# Altium project 50ohm-diff_converter.PrjPcb (part 3 of 3)
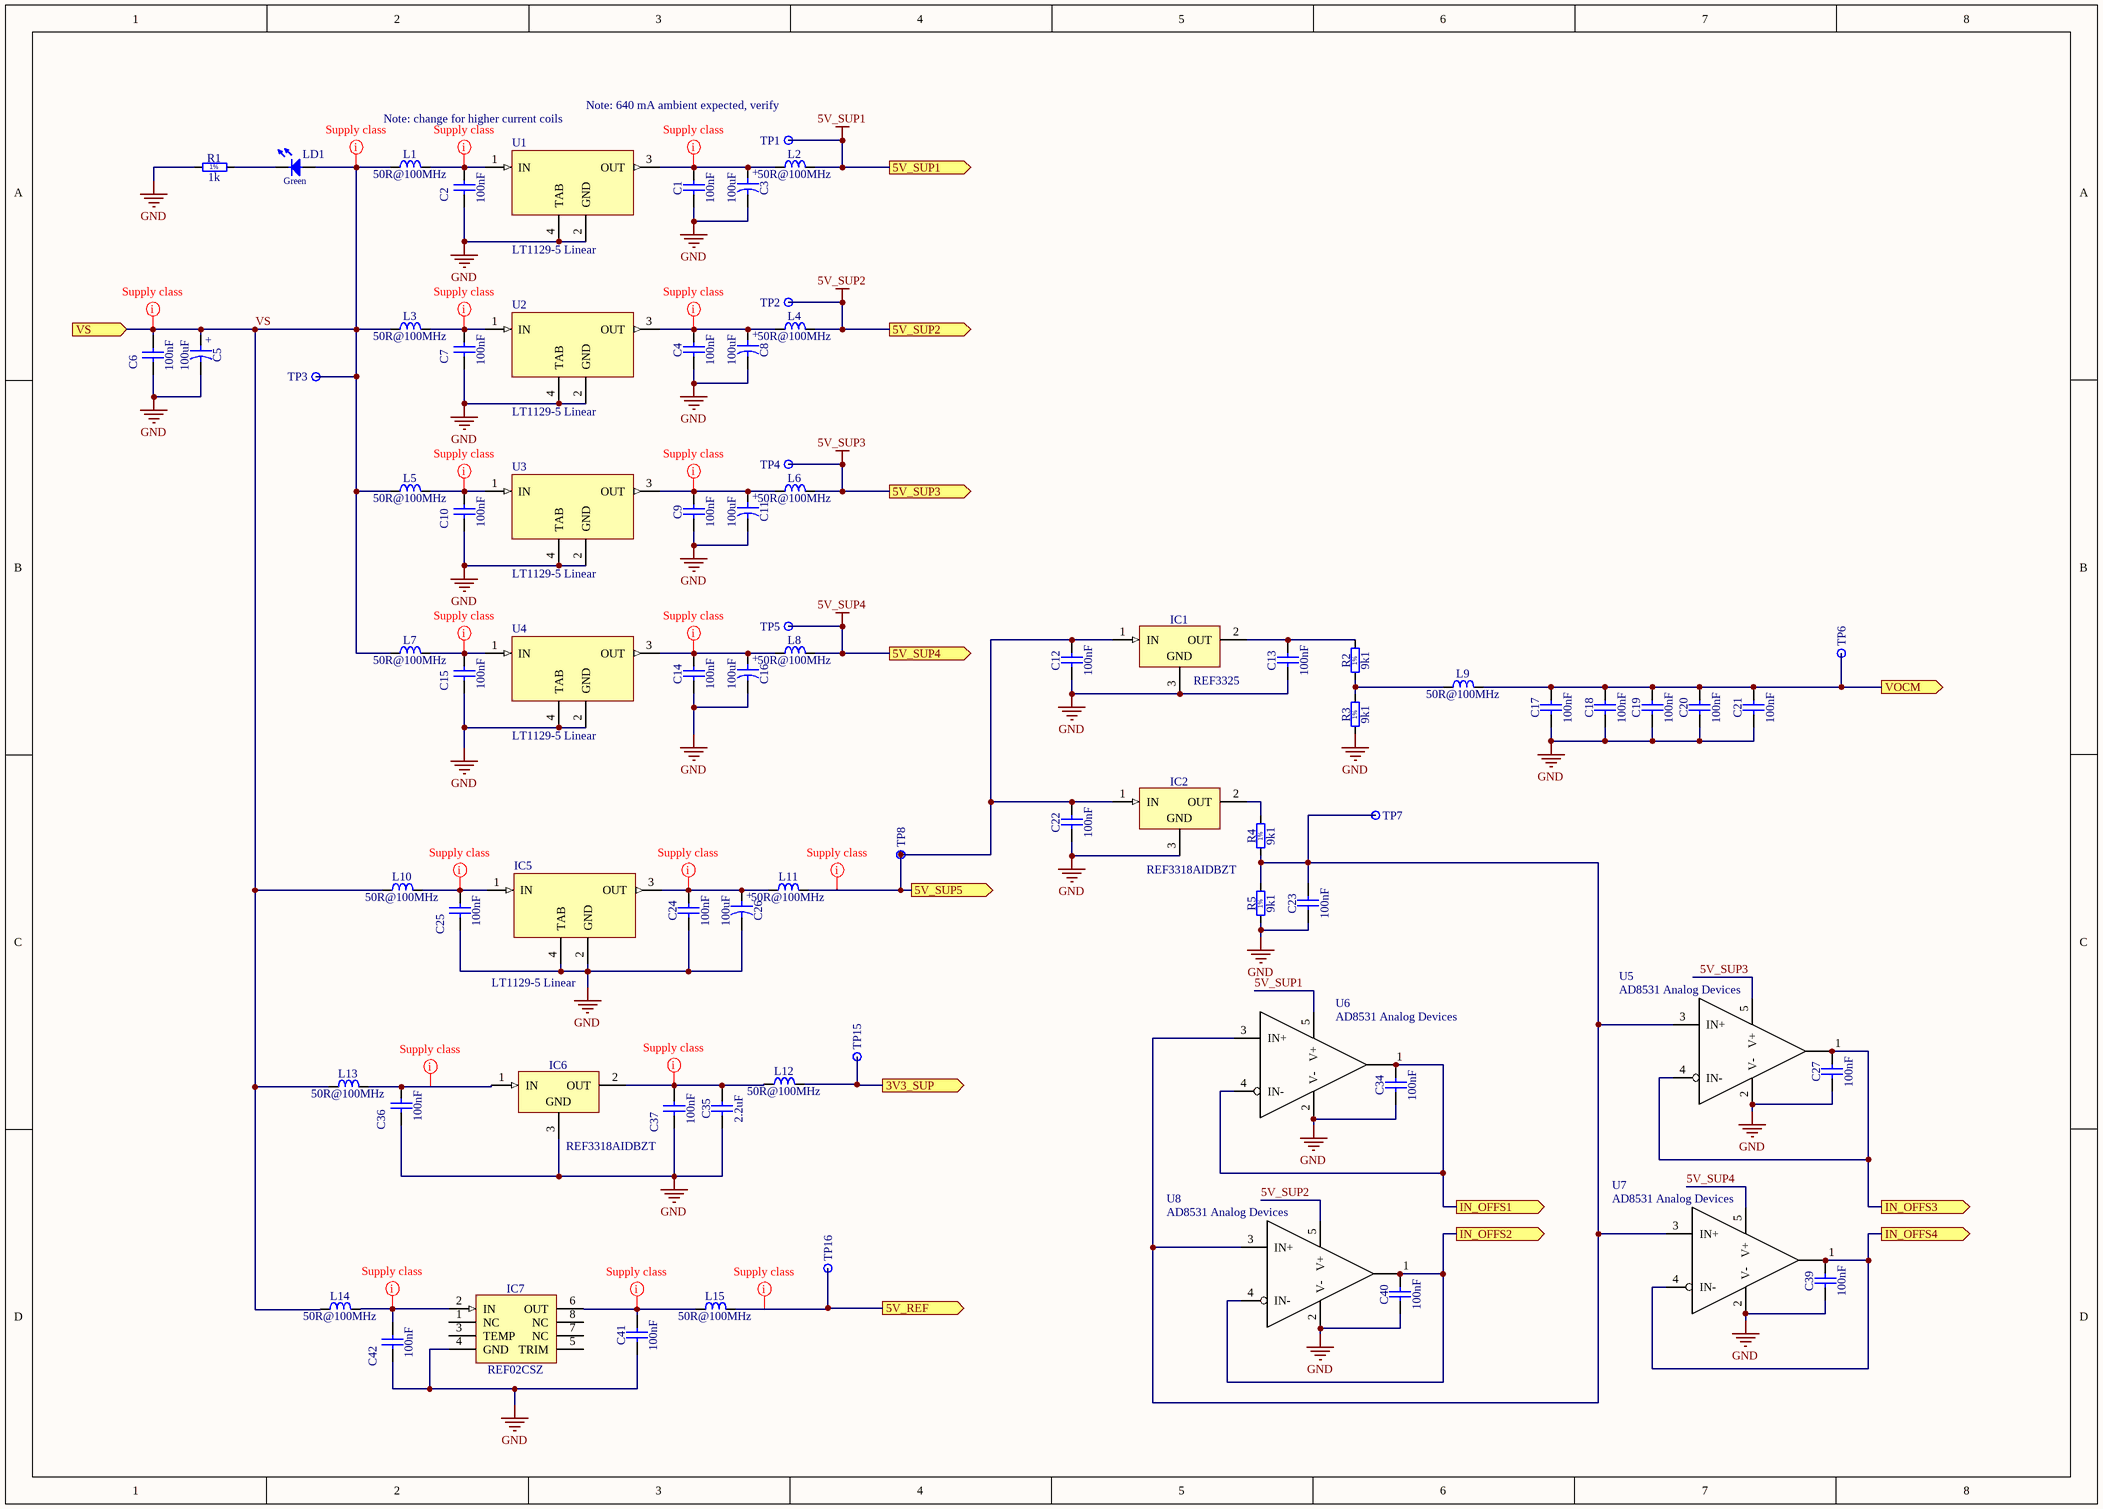
[diagram p9: Regulators_block.SchDoc]

## Nets that join several sheets
5V_SUP1: CH1 (R7_CH64_1.1), CH2 (R7_CH64_2.1), CH3 (R7_CH64_3.1), CH4 (R7_CH64_4.1), CH5 (R7_CH64_5.1), CH6 (R7_CH64_6.1), CH7 (R7_CH64_7.1), CH8 (R7_CH64_8.1), CH9 (R7_CH64_9.1), CH10 (R7_CH64_10.1), CH11 (R7_CH64_11.1), CH12 (R7_CH64_12.1), CH13 (R7_CH64_13.1), CH14 (R7_CH64_14.1), CH15 (R7_CH64_15.1), CH16 (R7_CH64_16.1), Regulators_block (L2.2 TP1.1 U6.5)
5V_SUP2: CH17 (R7_CH64_17.1), CH18 (R7_CH64_18.1), CH19 (R7_CH64_19.1), CH20 (R7_CH64_20.1), CH21 (R7_CH64_21.1), CH22 (R7_CH64_22.1), CH23 (R7_CH64_23.1), CH24 (R7_CH64_24.1), CH25 (R7_CH64_25.1), CH26 (R7_CH64_26.1), CH27 (R7_CH64_27.1), CH28 (R7_CH64_28.1), CH29 (R7_CH64_29.1), CH30 (R7_CH64_30.1), CH31 (R7_CH64_31.1), CH32 (R7_CH64_32.1), Regulators_block (L4.2 TP2.1 U8.5)
5V_SUP3: CH33 (R7_CH64_33.1), CH34 (R7_CH64_34.1), CH35 (R7_CH64_35.1), CH36 (R7_CH64_36.1), CH37 (R7_CH64_37.1), CH38 (R7_CH64_38.1), CH39 (R7_CH64_39.1), CH40 (R7_CH64_40.1), CH41 (R7_CH64_41.1), CH42 (R7_CH64_42.1), CH43 (R7_CH64_43.1), CH44 (R7_CH64_44.1), CH45 (R7_CH64_45.1), CH46 (R7_CH64_46.1), CH47 (R7_CH64_47.1), CH48 (R7_CH64_48.1), Regulators_block (L6.2 TP4.1 U5.5)
5V_SUP4: CH49 (R7_CH64_49.1), CH50 (R7_CH64_50.1), CH51 (R7_CH64_51.1), CH52 (R7_CH64_52.1), CH53 (R7_CH64_53.1), CH54 (R7_CH64_54.1), CH55 (R7_CH64_55.1), CH56 (R7_CH64_56.1), CH57 (R7_CH64_57.1), CH58 (R7_CH64_58.1), CH59 (R7_CH64_59.1), CH60 (R7_CH64_60.1), CH61 (R7_CH64_61.1), CH62 (R7_CH64_62.1), CH63 (R7_CH64_63.1), CH64 (R7_CH64_64.1), Regulators_block (L8.2 TP5.1 U7.5)
DGND: Bank (SW2.1 TP11.1), Output_block (5 pins), MCU (22 pins)
GND: Bank (7 pins), CH1 (C1_CH64_1.1 C29_1.1 U1_CH64_1.6), CH2 (C1_CH64_2.1 C29_2.1 U1_CH64_2.6), CH3 (C1_CH64_3.1 C29_3.1 U1_CH64_3.6), CH4 (C1_CH64_4.1 C29_4.1 U1_CH64_4.6), CH5 (C1_CH64_5.1 C29_5.1 U1_CH64_5.6), CH6 (C1_CH64_6.1 C29_6.1 U1_CH64_6.6), CH7 (C1_CH64_7.1 C29_7.1 U1_CH64_7.6), CH8 (C1_CH64_8.1 C29_8.1 U1_CH64_8.6), CH9 (C1_CH64_9.1 C29_9.1 U1_CH64_9.6), CH10 (C1_CH64_10.1 C29_10.1 U1_CH64_10.6), CH11 (C1_CH64_11.1 C29_11.1 U1_CH64_11.6), CH12 (C1_CH64_12.1 C29_12.1 U1_CH64_12.6), CH13 (C1_CH64_13.1 C29_13.1 U1_CH64_13.6), CH14 (C1_CH64_14.1 C29_14.1 U1_CH64_14.6), CH15 (C1_CH64_15.1 C29_15.1 U1_CH64_15.6), CH16 (C1_CH64_16.1 C29_16.1 U1_CH64_16.6), CH17 (C1_CH64_17.1 C29_17.1 U1_CH64_17.6), CH18 (C1_CH64_18.1 C29_18.1 U1_CH64_18.6), CH19 (C1_CH64_19.1 C29_19.1 U1_CH64_19.6), CH20 (C1_CH64_20.1 C29_20.1 U1_CH64_20.6), CH21 (C1_CH64_21.1 C29_21.1 U1_CH64_21.6), CH22 (C1_CH64_22.1 C29_22.1 U1_CH64_22.6), CH23 (C1_CH64_23.1 C29_23.1 U1_CH64_23.6), CH24 (C1_CH64_24.1 C29_24.1 U1_CH64_24.6), CH25 (C1_CH64_25.1 C29_25.1 U1_CH64_25.6), CH26 (C1_CH64_26.1 C29_26.1 U1_CH64_26.6), CH27 (C1_CH64_27.1 C29_27.1 U1_CH64_27.6), CH28 (C1_CH64_28.1 C29_28.1 U1_CH64_28.6), CH29 (C1_CH64_29.1 C29_29.1 U1_CH64_29.6), CH30 (C1_CH64_30.1 C29_30.1 U1_CH64_30.6), CH31 (C1_CH64_31.1 C29_31.1 U1_CH64_31.6), CH32 (C1_CH64_32.1 C29_32.1 U1_CH64_32.6), Output_block (75 pins), CH33 (C1_CH64_33.1 C29_33.1 U1_CH64_33.6), CH34 (C1_CH64_34.1 C29_34.1 U1_CH64_34.6), CH35 (C1_CH64_35.1 C29_35.1 U1_CH64_35.6), CH36 (C1_CH64_36.1 C29_36.1 U1_CH64_36.6), CH37 (C1_CH64_37.1 C29_37.1 U1_CH64_37.6), CH38 (C1_CH64_38.1 C29_38.1 U1_CH64_38.6), CH39 (C1_CH64_39.1 C29_39.1 U1_CH64_39.6), CH40 (C1_CH64_40.1 C29_40.1 U1_CH64_40.6), CH41 (C1_CH64_41.1 C29_41.1 U1_CH64_41.6), CH42 (C1_CH64_42.1 C29_42.1 U1_CH64_42.6), CH43 (C1_CH64_43.1 C29_43.1 U1_CH64_43.6), CH44 (C1_CH64_44.1 C29_44.1 U1_CH64_44.6), CH45 (C1_CH64_45.1 C29_45.1 U1_CH64_45.6), CH46 (C1_CH64_46.1 C29_46.1 U1_CH64_46.6), CH47 (C1_CH64_47.1 C29_47.1 U1_CH64_47.6), CH48 (C1_CH64_48.1 C29_48.1 U1_CH64_48.6), CH49 (C1_CH64_49.1 C29_49.1 U1_CH64_49.6), CH50 (C1_CH64_50.1 C29_50.1 U1_CH64_50.6), CH51 (C1_CH64_51.1 C29_51.1 U1_CH64_51.6), CH52 (C1_CH64_52.1 C29_52.1 U1_CH64_52.6), CH53 (C1_CH64_53.1 C29_53.1 U1_CH64_53.6), CH54 (C1_CH64_54.1 C29_54.1 U1_CH64_54.6), CH55 (C1_CH64_55.1 C29_55.1 U1_CH64_55.6), CH56 (C1_CH64_56.1 C29_56.1 U1_CH64_56.6), CH57 (C1_CH64_57.1 C29_57.1 U1_CH64_57.6), CH58 (C1_CH64_58.1 C29_58.1 U1_CH64_58.6), CH59 (C1_CH64_59.1 C29_59.1 U1_CH64_59.6), CH60 (C1_CH64_60.1 C29_60.1 U1_CH64_60.6), CH61 (C1_CH64_61.1 C29_61.1 U1_CH64_61.6), CH62 (C1_CH64_62.1 C29_62.1 U1_CH64_62.6), CH63 (C1_CH64_63.1 C29_63.1 U1_CH64_63.6), CH64 (C1_CH64_64.1 C29_64.1 U1_CH64_64.6), U_HV_Offset_block/U_DAC_Bank_A/U_DAC (9 pins), U_HV_Offset_block/U_DAC_Bank_A/U_DAC (8 pins), U_HV_Offset_block/U_DAC_Bank_A/U_DAC (8 pins), U_HV_Offset_block/U_DAC_Bank_A/U_DAC (7 pins), U_HV_Offset_block/U_DAC_Bank_B/U_DAC (9 pins), U_HV_Offset_block/U_DAC_Bank_B/U_DAC (8 pins), U_HV_Offset_block/U_DAC_Bank_B/U_DAC (8 pins), U_HV_Offset_block/U_DAC_Bank_B/U_DAC (7 pins), U_HV_Offset_block/U_DAC_Bank_C/U_DAC (9 pins), U_HV_Offset_block/U_DAC_Bank_C/U_DAC (8 pins), U_HV_Offset_block/U_DAC_Bank_C/U_DAC (8 pins), U_HV_Offset_block/U_DAC_Bank_C/U_DAC (7 pins), U_HV_Offset_block/U_DAC_Bank_D/U_DAC (9 pins), U_HV_Offset_block/U_DAC_Bank_D/U_DAC (8 pins), U_HV_Offset_block/U_DAC_Bank_D/U_DAC (8 pins), U_HV_Offset_block/U_DAC_Bank_D/U_DAC (7 pins), IJ1 (J2_1.2 R13_1.1), IJ2 (J2_2.2 R13_2.1), IJ3 (J2_3.2 R13_3.1), IJ4 (J2_4.2 R13_4.1), IJ5 (J2_5.2 R13_5.1), IJ6 (J2_6.2 R13_6.1), IJ7 (J2_7.2 R13_7.1), IJ8 (J2_8.2 R13_8.1), IJ9 (J2_9.2 R13_9.1), IJ10 (J2_10.2 R13_10.1), IJ11 (J2_11.2 R13_11.1), IJ12 (J2_12.2 R13_12.1), IJ13 (J2_13.2 R13_13.1), IJ14 (J2_14.2 R13_14.1), IJ15 (J2_15.2 R13_15.1), IJ16 (J2_16.2 R13_16.1), IJ17 (J2_17.2 R13_17.1), IJ18 (J2_18.2 R13_18.1), IJ19 (J2_19.2 R13_19.1), IJ20 (J2_20.2 R13_20.1), IJ21 (J2_21.2 R13_21.1), IJ22 (J2_22.2 R13_22.1), IJ23 (J2_23.2 R13_23.1), IJ24 (J2_24.2 R13_24.1), IJ25 (J2_25.2 R13_25.1), IJ26 (J2_26.2 R13_26.1), IJ27 (J2_27.2 R13_27.1), IJ28 (J2_28.2 R13_28.1), IJ29 (J2_29.2 R13_29.1), IJ30 (J2_30.2 R13_30.1), IJ31 (J2_31.2 R13_31.1), IJ32 (J2_32.2 R13_32.1), IJ33 (J2_33.2 R13_33.1), IJ34 (J2_34.2 R13_34.1), IJ35 (J2_35.2 R13_35.1), IJ36 (J2_36.2 R13_36.1), IJ37 (J2_37.2 R13_37.1), IJ38 (J2_38.2 R13_38.1), IJ39 (J2_39.2 R13_39.1), IJ40 (J2_40.2 R13_40.1), IJ41 (J2_41.2 R13_41.1), IJ42 (J2_42.2 R13_42.1), IJ43 (J2_43.2 R13_43.1), IJ44 (J2_44.2 R13_44.1), IJ45 (J2_45.2 R13_45.1), IJ46 (J2_46.2 R13_46.1), IJ47 (J2_47.2 R13_47.1), IJ48 (J2_48.2 R13_48.1), IJ49 (J2_49.2 R13_49.1), IJ50 (J2_50.2 R13_50.1), IJ51 (J2_51.2 R13_51.1), IJ52 (J2_52.2 R13_52.1), IJ53 (J2_53.2 R13_53.1), IJ54 (J2_54.2 R13_54.1), IJ55 (J2_55.2 R13_55.1), IJ56 (J2_56.2 R13_56.1), IJ57 (J2_57.2 R13_57.1), IJ58 (J2_58.2 R13_58.1), IJ59 (J2_59.2 R13_59.1), IJ60 (J2_60.2 R13_60.1), IJ61 (J2_61.2 R13_61.1), IJ62 (J2_62.2 R13_62.1), IJ63 (J2_63.2 R13_63.1), IJ64 (J2_64.2 R13_64.1), MCU (R20.1 R22.1 R23.1 R24.1), Regulators_block (56 pins)
IN_OFFS1: CH1 (C29_1.2 R3_CH64_1.1), CH2 (C29_2.2 R3_CH64_2.1), CH3 (C29_3.2 R3_CH64_3.1), CH4 (C29_4.2 R3_CH64_4.1), CH5 (C29_5.2 R3_CH64_5.1), CH6 (C29_6.2 R3_CH64_6.1), CH7 (C29_7.2 R3_CH64_7.1), CH8 (C29_8.2 R3_CH64_8.1), CH9 (C29_9.2 R3_CH64_9.1), CH10 (C29_10.2 R3_CH64_10.1), CH11 (C29_11.2 R3_CH64_11.1), CH12 (C29_12.2 R3_CH64_12.1), CH13 (C29_13.2 R3_CH64_13.1), CH14 (C29_14.2 R3_CH64_14.1), CH15 (C29_15.2 R3_CH64_15.1), CH16 (C29_16.2 R3_CH64_16.1), Regulators_block (C34.2 U6.1 U6.4)
IN_OFFS2: CH17 (C29_17.2 R3_CH64_17.1), CH18 (C29_18.2 R3_CH64_18.1), CH19 (C29_19.2 R3_CH64_19.1), CH20 (C29_20.2 R3_CH64_20.1), CH21 (C29_21.2 R3_CH64_21.1), CH22 (C29_22.2 R3_CH64_22.1), CH23 (C29_23.2 R3_CH64_23.1), CH24 (C29_24.2 R3_CH64_24.1), CH25 (C29_25.2 R3_CH64_25.1), CH26 (C29_26.2 R3_CH64_26.1), CH27 (C29_27.2 R3_CH64_27.1), CH28 (C29_28.2 R3_CH64_28.1), CH29 (C29_29.2 R3_CH64_29.1), CH30 (C29_30.2 R3_CH64_30.1), CH31 (C29_31.2 R3_CH64_31.1), CH32 (C29_32.2 R3_CH64_32.1), Regulators_block (C40.2 U8.1 U8.4)
IN_OFFS3: CH33 (C29_33.2 R3_CH64_33.1), CH34 (C29_34.2 R3_CH64_34.1), CH35 (C29_35.2 R3_CH64_35.1), CH36 (C29_36.2 R3_CH64_36.1), CH37 (C29_37.2 R3_CH64_37.1), CH38 (C29_38.2 R3_CH64_38.1), CH39 (C29_39.2 R3_CH64_39.1), CH40 (C29_40.2 R3_CH64_40.1), CH41 (C29_41.2 R3_CH64_41.1), CH42 (C29_42.2 R3_CH64_42.1), CH43 (C29_43.2 R3_CH64_43.1), CH44 (C29_44.2 R3_CH64_44.1), CH45 (C29_45.2 R3_CH64_45.1), CH46 (C29_46.2 R3_CH64_46.1), CH47 (C29_47.2 R3_CH64_47.1), CH48 (C29_48.2 R3_CH64_48.1), Regulators_block (C27.2 U5.1 U5.4)
IN_OFFS4: CH49 (C29_49.2 R3_CH64_49.1), CH50 (C29_50.2 R3_CH64_50.1), CH51 (C29_51.2 R3_CH64_51.1), CH52 (C29_52.2 R3_CH64_52.1), CH53 (C29_53.2 R3_CH64_53.1), CH54 (C29_54.2 R3_CH64_54.1), CH55 (C29_55.2 R3_CH64_55.1), CH56 (C29_56.2 R3_CH64_56.1), CH57 (C29_57.2 R3_CH64_57.1), CH58 (C29_58.2 R3_CH64_58.1), CH59 (C29_59.2 R3_CH64_59.1), CH60 (C29_60.2 R3_CH64_60.1), CH61 (C29_61.2 R3_CH64_61.1), CH62 (C29_62.2 R3_CH64_62.1), CH63 (C29_63.2 R3_CH64_63.1), CH64 (C29_64.2 R3_CH64_64.1), Regulators_block (C39.2 U7.1 U7.4)
VDD: U_HV_Offset_block/U_DAC_Bank_A/U_DAC (C33_1.2 IC4_1.12), U_HV_Offset_block/U_DAC_Bank_A/U_DAC (C33_2.2 IC4_2.12 IC4_2.13), U_HV_Offset_block/U_DAC_Bank_A/U_DAC (C33_3.2 IC4_3.12 IC4_3.14), U_HV_Offset_block/U_DAC_Bank_A/U_DAC (C33_4.2 IC4_4.12 IC4_4.13 IC4_4.14), U_HV_Offset_block/U_DAC_Bank_B/U_DAC (C33_5.2 IC4_5.12), U_HV_Offset_block/U_DAC_Bank_B/U_DAC (C33_6.2 IC4_6.12 IC4_6.13), U_HV_Offset_block/U_DAC_Bank_B/U_DAC (C33_7.2 IC4_7.12 IC4_7.14), U_HV_Offset_block/U_DAC_Bank_B/U_DAC (C33_8.2 IC4_8.12 IC4_8.13 IC4_8.14), U_HV_Offset_block/U_DAC_Bank_C/U_DAC (C33_9.2 IC4_9.12), U_HV_Offset_block/U_DAC_Bank_C/U_DAC (C33_10.2 IC4_10.12 IC4_10.13), U_HV_Offset_block/U_DAC_Bank_C/U_DAC (C33_11.2 IC4_11.12 IC4_11.14), U_HV_Offset_block/U_DAC_Bank_C/U_DAC (C33_12.2 IC4_12.12 IC4_12.13 IC4_12.14), U_HV_Offset_block/U_DAC_Bank_D/U_DAC (C33_13.2 IC4_13.12), U_HV_Offset_block/U_DAC_Bank_D/U_DAC (C33_14.2 IC4_14.12 IC4_14.13), U_HV_Offset_block/U_DAC_Bank_D/U_DAC (C33_15.2 IC4_15.12 IC4_15.14), U_HV_Offset_block/U_DAC_Bank_D/U_DAC (C33_16.2 IC4_16.12 IC4_16.13 IC4_16.14), MCU (19 pins), Regulators_block (L12.2 TP15.1)
VOCM: CH1 (U1_CH64_1.2), CH2 (U1_CH64_2.2), CH3 (U1_CH64_3.2), CH4 (U1_CH64_4.2), CH5 (U1_CH64_5.2), CH6 (U1_CH64_6.2), CH7 (U1_CH64_7.2), CH8 (U1_CH64_8.2), CH9 (U1_CH64_9.2), CH10 (U1_CH64_10.2), CH11 (U1_CH64_11.2), CH12 (U1_CH64_12.2), CH13 (U1_CH64_13.2), CH14 (U1_CH64_14.2), CH15 (U1_CH64_15.2), CH16 (U1_CH64_16.2), CH17 (U1_CH64_17.2), CH18 (U1_CH64_18.2), CH19 (U1_CH64_19.2), CH20 (U1_CH64_20.2), CH21 (U1_CH64_21.2), CH22 (U1_CH64_22.2), CH23 (U1_CH64_23.2), CH24 (U1_CH64_24.2), CH25 (U1_CH64_25.2), CH26 (U1_CH64_26.2), CH27 (U1_CH64_27.2), CH28 (U1_CH64_28.2), CH29 (U1_CH64_29.2), CH30 (U1_CH64_30.2), CH31 (U1_CH64_31.2), CH32 (U1_CH64_32.2), CH33 (U1_CH64_33.2), CH34 (U1_CH64_34.2), CH35 (U1_CH64_35.2), CH36 (U1_CH64_36.2), CH37 (U1_CH64_37.2), CH38 (U1_CH64_38.2), CH39 (U1_CH64_39.2), CH40 (U1_CH64_40.2), CH41 (U1_CH64_41.2), CH42 (U1_CH64_42.2), CH43 (U1_CH64_43.2), CH44 (U1_CH64_44.2), CH45 (U1_CH64_45.2), CH46 (U1_CH64_46.2), CH47 (U1_CH64_47.2), CH48 (U1_CH64_48.2), CH49 (U1_CH64_49.2), CH50 (U1_CH64_50.2), CH51 (U1_CH64_51.2), CH52 (U1_CH64_52.2), CH53 (U1_CH64_53.2), CH54 (U1_CH64_54.2), CH55 (U1_CH64_55.2), CH56 (U1_CH64_56.2), CH57 (U1_CH64_57.2), CH58 (U1_CH64_58.2), CH59 (U1_CH64_59.2), CH60 (U1_CH64_60.2), CH61 (U1_CH64_61.2), CH62 (U1_CH64_62.2), CH63 (U1_CH64_63.2), CH64 (U1_CH64_64.2), Regulators_block (7 pins)
CS0: U_HV_Offset_block/U_DAC_Bank_A/U_DAC (IC4_1.15), U_HV_Offset_block/U_DAC_Bank_A/U_DAC (IC4_2.15), U_HV_Offset_block/U_DAC_Bank_A/U_DAC (IC4_3.15), U_HV_Offset_block/U_DAC_Bank_A/U_DAC (IC4_4.15), MCU (IC8.25 LD3.2)
CS1: U_HV_Offset_block/U_DAC_Bank_B/U_DAC (IC4_5.15), U_HV_Offset_block/U_DAC_Bank_B/U_DAC (IC4_6.15), U_HV_Offset_block/U_DAC_Bank_B/U_DAC (IC4_7.15), U_HV_Offset_block/U_DAC_Bank_B/U_DAC (IC4_8.15), MCU (IC8.26 LD4.2)
CS2: U_HV_Offset_block/U_DAC_Bank_C/U_DAC (IC4_9.15), U_HV_Offset_block/U_DAC_Bank_C/U_DAC (IC4_10.15), U_HV_Offset_block/U_DAC_Bank_C/U_DAC (IC4_11.15), U_HV_Offset_block/U_DAC_Bank_C/U_DAC (IC4_12.15), MCU (IC8.27 LD5.2)
CS3: U_HV_Offset_block/U_DAC_Bank_D/U_DAC (IC4_13.15), U_HV_Offset_block/U_DAC_Bank_D/U_DAC (IC4_14.15), U_HV_Offset_block/U_DAC_Bank_D/U_DAC (IC4_15.15), U_HV_Offset_block/U_DAC_Bank_D/U_DAC (IC4_16.15), MCU (IC8.28 LD6.2)
DIFF_N1: CH1 (R1_CH64_1.2 TP4_CH64_1.1 U1_CH64_1.5), Output_block (J3.48)
DIFF_N2: CH2 (R1_CH64_2.2 TP4_CH64_2.1 U1_CH64_2.5), Output_block (J3.47)
DIFF_N3: CH3 (R1_CH64_3.2 TP4_CH64_3.1 U1_CH64_3.5), Output_block (J3.54)
DIFF_N4: CH4 (R1_CH64_4.2 TP4_CH64_4.1 U1_CH64_4.5), Output_block (J3.53)
DIFF_N5: CH5 (R1_CH64_5.2 TP4_CH64_5.1 U1_CH64_5.5), Output_block (J3.60)
DIFF_N6: CH6 (R1_CH64_6.2 TP4_CH64_6.1 U1_CH64_6.5), Output_block (J3.59)
DIFF_N7: CH7 (R1_CH64_7.2 TP4_CH64_7.1 U1_CH64_7.5), Output_block (J3.66)
DIFF_N8: CH8 (R1_CH64_8.2 TP4_CH64_8.1 U1_CH64_8.5), Output_block (J3.65)
DIFF_N9: CH9 (R1_CH64_9.2 TP4_CH64_9.1 U1_CH64_9.5), Output_block (J3.72)
DIFF_N10: CH10 (R1_CH64_10.2 TP4_CH64_10.1 U1_CH64_10.5), Output_block (J3.71)
DIFF_N11: CH11 (R1_CH64_11.2 TP4_CH64_11.1 U1_CH64_11.5), Output_block (J3.78)
DIFF_N12: CH12 (R1_CH64_12.2 TP4_CH64_12.1 U1_CH64_12.5), Output_block (J3.77)
DIFF_N13: CH13 (R1_CH64_13.2 TP4_CH64_13.1 U1_CH64_13.5), Output_block (J3.84)
DIFF_N14: CH14 (R1_CH64_14.2 TP4_CH64_14.1 U1_CH64_14.5), Output_block (J3.83)
DIFF_N15: CH15 (R1_CH64_15.2 TP4_CH64_15.1 U1_CH64_15.5), Output_block (J3.90)
DIFF_N16: CH16 (R1_CH64_16.2 TP4_CH64_16.1 U1_CH64_16.5), Output_block (J3.89)
DIFF_N17: CH17 (R1_CH64_17.2 TP4_CH64_17.1 U1_CH64_17.5), Output_block (J3.96)
DIFF_N18: CH18 (R1_CH64_18.2 TP4_CH64_18.1 U1_CH64_18.5), Output_block (J3.95)
DIFF_N19: CH19 (R1_CH64_19.2 TP4_CH64_19.1 U1_CH64_19.5), Output_block (J3.102)
DIFF_N20: CH20 (R1_CH64_20.2 TP4_CH64_20.1 U1_CH64_20.5), Output_block (J3.101)
DIFF_N21: CH21 (R1_CH64_21.2 TP4_CH64_21.1 U1_CH64_21.5), Output_block (J3.108)
DIFF_N22: CH22 (R1_CH64_22.2 TP4_CH64_22.1 U1_CH64_22.5), Output_block (J3.107)
DIFF_N23: CH23 (R1_CH64_23.2 TP4_CH64_23.1 U1_CH64_23.5), Output_block (J3.114)
DIFF_N24: CH24 (R1_CH64_24.2 TP4_CH64_24.1 U1_CH64_24.5), Output_block (J3.113)
DIFF_N25: CH25 (R1_CH64_25.2 TP4_CH64_25.1 U1_CH64_25.5), Output_block (J3.120)
DIFF_N26: CH26 (R1_CH64_26.2 TP4_CH64_26.1 U1_CH64_26.5), Output_block (J3.119)
DIFF_N27: CH27 (R1_CH64_27.2 TP4_CH64_27.1 U1_CH64_27.5), Output_block (J3.126)
DIFF_N28: CH28 (R1_CH64_28.2 TP4_CH64_28.1 U1_CH64_28.5), Output_block (J3.125)
DIFF_N29: CH29 (R1_CH64_29.2 TP4_CH64_29.1 U1_CH64_29.5), Output_block (J3.132)
DIFF_N30: CH30 (R1_CH64_30.2 TP4_CH64_30.1 U1_CH64_30.5), Output_block (J3.131)
DIFF_N31: CH31 (R1_CH64_31.2 TP4_CH64_31.1 U1_CH64_31.5), Output_block (J3.138)
DIFF_N32: CH32 (R1_CH64_32.2 TP4_CH64_32.1 U1_CH64_32.5), Output_block (J3.137)
DIFF_N33: Output_block (J4.6), CH33 (R1_CH64_33.2 TP4_CH64_33.1 U1_CH64_33.5)
DIFF_N34: Output_block (J4.5), CH34 (R1_CH64_34.2 TP4_CH64_34.1 U1_CH64_34.5)
DIFF_N35: Output_block (J4.12), CH35 (R1_CH64_35.2 TP4_CH64_35.1 U1_CH64_35.5)
DIFF_N36: Output_block (J4.11), CH36 (R1_CH64_36.2 TP4_CH64_36.1 U1_CH64_36.5)
DIFF_N37: Output_block (J4.18), CH37 (R1_CH64_37.2 TP4_CH64_37.1 U1_CH64_37.5)
DIFF_N38: Output_block (J4.17), CH38 (R1_CH64_38.2 TP4_CH64_38.1 U1_CH64_38.5)
DIFF_N39: Output_block (J4.24), CH39 (R1_CH64_39.2 TP4_CH64_39.1 U1_CH64_39.5)
DIFF_N40: Output_block (J4.23), CH40 (R1_CH64_40.2 TP4_CH64_40.1 U1_CH64_40.5)
DIFF_N41: Output_block (J4.30), CH41 (R1_CH64_41.2 TP4_CH64_41.1 U1_CH64_41.5)
DIFF_N42: Output_block (J4.29), CH42 (R1_CH64_42.2 TP4_CH64_42.1 U1_CH64_42.5)
DIFF_N43: Output_block (J4.36), CH43 (R1_CH64_43.2 TP4_CH64_43.1 U1_CH64_43.5)
DIFF_N44: Output_block (J4.35), CH44 (R1_CH64_44.2 TP4_CH64_44.1 U1_CH64_44.5)
DIFF_N45: Output_block (J4.42), CH45 (R1_CH64_45.2 TP4_CH64_45.1 U1_CH64_45.5)
DIFF_N46: Output_block (J4.41), CH46 (R1_CH64_46.2 TP4_CH64_46.1 U1_CH64_46.5)
DIFF_N47: Output_block (J4.48), CH47 (R1_CH64_47.2 TP4_CH64_47.1 U1_CH64_47.5)
DIFF_N48: Output_block (J4.47), CH48 (R1_CH64_48.2 TP4_CH64_48.1 U1_CH64_48.5)
DIFF_N49: Output_block (J4.54), CH49 (R1_CH64_49.2 TP4_CH64_49.1 U1_CH64_49.5)
DIFF_N50: Output_block (J4.53), CH50 (R1_CH64_50.2 TP4_CH64_50.1 U1_CH64_50.5)
DIFF_N51: Output_block (J4.60), CH51 (R1_CH64_51.2 TP4_CH64_51.1 U1_CH64_51.5)
DIFF_N52: Output_block (J4.59), CH52 (R1_CH64_52.2 TP4_CH64_52.1 U1_CH64_52.5)
DIFF_N53: Output_block (J4.66), CH53 (R1_CH64_53.2 TP4_CH64_53.1 U1_CH64_53.5)
DIFF_N54: Output_block (J4.65), CH54 (R1_CH64_54.2 TP4_CH64_54.1 U1_CH64_54.5)
DIFF_N55: Output_block (J4.72), CH55 (R1_CH64_55.2 TP4_CH64_55.1 U1_CH64_55.5)
DIFF_N56: Output_block (J4.71), CH56 (R1_CH64_56.2 TP4_CH64_56.1 U1_CH64_56.5)
DIFF_N57: Output_block (J4.78), CH57 (R1_CH64_57.2 TP4_CH64_57.1 U1_CH64_57.5)
DIFF_N58: Output_block (J4.77), CH58 (R1_CH64_58.2 TP4_CH64_58.1 U1_CH64_58.5)
DIFF_N59: Output_block (J4.84), CH59 (R1_CH64_59.2 TP4_CH64_59.1 U1_CH64_59.5)
DIFF_N60: Output_block (J4.83), CH60 (R1_CH64_60.2 TP4_CH64_60.1 U1_CH64_60.5)
DIFF_N61: Output_block (J4.90), CH61 (R1_CH64_61.2 TP4_CH64_61.1 U1_CH64_61.5)
DIFF_N62: Output_block (J4.89), CH62 (R1_CH64_62.2 TP4_CH64_62.1 U1_CH64_62.5)
DIFF_N63: Output_block (J4.96), CH63 (R1_CH64_63.2 TP4_CH64_63.1 U1_CH64_63.5)
DIFF_N64: Output_block (J4.95), CH64 (R1_CH64_64.2 TP4_CH64_64.1 U1_CH64_64.5)
DIFF_P1: CH1 (R8_CH64_1.2 TP5_CH64_1.1 U1_CH64_1.4), Output_block (J3.46)
DIFF_P2: CH2 (R8_CH64_2.2 TP5_CH64_2.1 U1_CH64_2.4), Output_block (J3.45)
DIFF_P3: CH3 (R8_CH64_3.2 TP5_CH64_3.1 U1_CH64_3.4), Output_block (J3.52)
DIFF_P4: CH4 (R8_CH64_4.2 TP5_CH64_4.1 U1_CH64_4.4), Output_block (J3.51)
DIFF_P5: CH5 (R8_CH64_5.2 TP5_CH64_5.1 U1_CH64_5.4), Output_block (J3.58)
DIFF_P6: CH6 (R8_CH64_6.2 TP5_CH64_6.1 U1_CH64_6.4), Output_block (J3.57)
DIFF_P7: CH7 (R8_CH64_7.2 TP5_CH64_7.1 U1_CH64_7.4), Output_block (J3.64)
DIFF_P8: CH8 (R8_CH64_8.2 TP5_CH64_8.1 U1_CH64_8.4), Output_block (J3.63)
DIFF_P9: CH9 (R8_CH64_9.2 TP5_CH64_9.1 U1_CH64_9.4), Output_block (J3.70)
DIFF_P10: CH10 (R8_CH64_10.2 TP5_CH64_10.1 U1_CH64_10.4), Output_block (J3.69)
DIFF_P11: CH11 (R8_CH64_11.2 TP5_CH64_11.1 U1_CH64_11.4), Output_block (J3.76)
DIFF_P12: CH12 (R8_CH64_12.2 TP5_CH64_12.1 U1_CH64_12.4), Output_block (J3.75)
DIFF_P13: CH13 (R8_CH64_13.2 TP5_CH64_13.1 U1_CH64_13.4), Output_block (J3.82)
DIFF_P14: CH14 (R8_CH64_14.2 TP5_CH64_14.1 U1_CH64_14.4), Output_block (J3.81)
DIFF_P15: CH15 (R8_CH64_15.2 TP5_CH64_15.1 U1_CH64_15.4), Output_block (J3.88)
DIFF_P16: CH16 (R8_CH64_16.2 TP5_CH64_16.1 U1_CH64_16.4), Output_block (J3.87)
DIFF_P17: CH17 (R8_CH64_17.2 TP5_CH64_17.1 U1_CH64_17.4), Output_block (J3.94)
DIFF_P18: CH18 (R8_CH64_18.2 TP5_CH64_18.1 U1_CH64_18.4), Output_block (J3.93)
DIFF_P19: CH19 (R8_CH64_19.2 TP5_CH64_19.1 U1_CH64_19.4), Output_block (J3.100)
DIFF_P20: CH20 (R8_CH64_20.2 TP5_CH64_20.1 U1_CH64_20.4), Output_block (J3.99)
DIFF_P21: CH21 (R8_CH64_21.2 TP5_CH64_21.1 U1_CH64_21.4), Output_block (J3.106)
DIFF_P22: CH22 (R8_CH64_22.2 TP5_CH64_22.1 U1_CH64_22.4), Output_block (J3.105)
DIFF_P23: CH23 (R8_CH64_23.2 TP5_CH64_23.1 U1_CH64_23.4), Output_block (J3.112)
DIFF_P24: CH24 (R8_CH64_24.2 TP5_CH64_24.1 U1_CH64_24.4), Output_block (J3.111)
DIFF_P25: CH25 (R8_CH64_25.2 TP5_CH64_25.1 U1_CH64_25.4), Output_block (J3.118)
DIFF_P26: CH26 (R8_CH64_26.2 TP5_CH64_26.1 U1_CH64_26.4), Output_block (J3.117)
DIFF_P27: CH27 (R8_CH64_27.2 TP5_CH64_27.1 U1_CH64_27.4), Output_block (J3.124)
DIFF_P28: CH28 (R8_CH64_28.2 TP5_CH64_28.1 U1_CH64_28.4), Output_block (J3.123)
DIFF_P29: CH29 (R8_CH64_29.2 TP5_CH64_29.1 U1_CH64_29.4), Output_block (J3.130)
DIFF_P30: CH30 (R8_CH64_30.2 TP5_CH64_30.1 U1_CH64_30.4), Output_block (J3.129)
DIFF_P31: CH31 (R8_CH64_31.2 TP5_CH64_31.1 U1_CH64_31.4), Output_block (J3.136)
DIFF_P32: CH32 (R8_CH64_32.2 TP5_CH64_32.1 U1_CH64_32.4), Output_block (J3.135)
DIFF_P33: Output_block (J4.4), CH33 (R8_CH64_33.2 TP5_CH64_33.1 U1_CH64_33.4)
DIFF_P34: Output_block (J4.3), CH34 (R8_CH64_34.2 TP5_CH64_34.1 U1_CH64_34.4)
DIFF_P35: Output_block (J4.10), CH35 (R8_CH64_35.2 TP5_CH64_35.1 U1_CH64_35.4)
DIFF_P36: Output_block (J4.9), CH36 (R8_CH64_36.2 TP5_CH64_36.1 U1_CH64_36.4)
DIFF_P37: Output_block (J4.16), CH37 (R8_CH64_37.2 TP5_CH64_37.1 U1_CH64_37.4)
DIFF_P38: Output_block (J4.15), CH38 (R8_CH64_38.2 TP5_CH64_38.1 U1_CH64_38.4)
DIFF_P39: Output_block (J4.22), CH39 (R8_CH64_39.2 TP5_CH64_39.1 U1_CH64_39.4)
DIFF_P40: Output_block (J4.21), CH40 (R8_CH64_40.2 TP5_CH64_40.1 U1_CH64_40.4)
DIFF_P41: Output_block (J4.28), CH41 (R8_CH64_41.2 TP5_CH64_41.1 U1_CH64_41.4)
DIFF_P42: Output_block (J4.27), CH42 (R8_CH64_42.2 TP5_CH64_42.1 U1_CH64_42.4)
DIFF_P43: Output_block (J4.34), CH43 (R8_CH64_43.2 TP5_CH64_43.1 U1_CH64_43.4)
DIFF_P44: Output_block (J4.33), CH44 (R8_CH64_44.2 TP5_CH64_44.1 U1_CH64_44.4)
DIFF_P45: Output_block (J4.40), CH45 (R8_CH64_45.2 TP5_CH64_45.1 U1_CH64_45.4)
DIFF_P46: Output_block (J4.39), CH46 (R8_CH64_46.2 TP5_CH64_46.1 U1_CH64_46.4)
DIFF_P47: Output_block (J4.46), CH47 (R8_CH64_47.2 TP5_CH64_47.1 U1_CH64_47.4)
DIFF_P48: Output_block (J4.45), CH48 (R8_CH64_48.2 TP5_CH64_48.1 U1_CH64_48.4)
DIFF_P49: Output_block (J4.52), CH49 (R8_CH64_49.2 TP5_CH64_49.1 U1_CH64_49.4)
DIFF_P50: Output_block (J4.51), CH50 (R8_CH64_50.2 TP5_CH64_50.1 U1_CH64_50.4)
DIFF_P51: Output_block (J4.58), CH51 (R8_CH64_51.2 TP5_CH64_51.1 U1_CH64_51.4)
DIFF_P52: Output_block (J4.57), CH52 (R8_CH64_52.2 TP5_CH64_52.1 U1_CH64_52.4)
DIFF_P53: Output_block (J4.64), CH53 (R8_CH64_53.2 TP5_CH64_53.1 U1_CH64_53.4)
DIFF_P54: Output_block (J4.63), CH54 (R8_CH64_54.2 TP5_CH64_54.1 U1_CH64_54.4)
DIFF_P55: Output_block (J4.70), CH55 (R8_CH64_55.2 TP5_CH64_55.1 U1_CH64_55.4)
DIFF_P56: Output_block (J4.69), CH56 (R8_CH64_56.2 TP5_CH64_56.1 U1_CH64_56.4)
DIFF_P57: Output_block (J4.76), CH57 (R8_CH64_57.2 TP5_CH64_57.1 U1_CH64_57.4)
DIFF_P58: Output_block (J4.75), CH58 (R8_CH64_58.2 TP5_CH64_58.1 U1_CH64_58.4)
DIFF_P59: Output_block (J4.82), CH59 (R8_CH64_59.2 TP5_CH64_59.1 U1_CH64_59.4)
DIFF_P60: Output_block (J4.81), CH60 (R8_CH64_60.2 TP5_CH64_60.1 U1_CH64_60.4)
DIFF_P61: Output_block (J4.88), CH61 (R8_CH64_61.2 TP5_CH64_61.1 U1_CH64_61.4)
DIFF_P62: Output_block (J4.87), CH62 (R8_CH64_62.2 TP5_CH64_62.1 U1_CH64_62.4)
DIFF_P63: Output_block (J4.94), CH63 (R8_CH64_63.2 TP5_CH64_63.1 U1_CH64_63.4)
DIFF_P64: Output_block (J4.93), CH64 (R8_CH64_64.2 TP5_CH64_64.1 U1_CH64_64.4)
HV_OFF1: U_HV_Offset_block/U_DAC_Bank_D/U_DAC (IC3_13.2), IJ1 (R12_1.2)
HV_OFF2: U_HV_Offset_block/U_DAC_Bank_D/U_DAC (IC3_15.2), IJ2 (R12_2.2)
HV_OFF3: U_HV_Offset_block/U_DAC_Bank_D/U_DAC (IC3_13.4), IJ3 (R12_3.2)
HV_OFF4: U_HV_Offset_block/U_DAC_Bank_D/U_DAC (IC3_15.4), IJ4 (R12_4.2)
HV_OFF5: U_HV_Offset_block/U_DAC_Bank_D/U_DAC (IC3_13.7), IJ5 (R12_5.2)
HV_OFF6: U_HV_Offset_block/U_DAC_Bank_D/U_DAC (IC3_15.7), IJ6 (R12_6.2)
HV_OFF7: U_HV_Offset_block/U_DAC_Bank_D/U_DAC (IC3_13.9), IJ7 (R12_7.2)
HV_OFF8: U_HV_Offset_block/U_DAC_Bank_D/U_DAC (IC3_15.9), IJ8 (R12_8.2)
HV_OFF9: U_HV_Offset_block/U_DAC_Bank_D/U_DAC (IC3_14.2), IJ9 (R12_9.2)
HV_OFF10: U_HV_Offset_block/U_DAC_Bank_D/U_DAC (IC3_16.2), IJ10 (R12_10.2)
HV_OFF11: U_HV_Offset_block/U_DAC_Bank_D/U_DAC (IC3_14.4), IJ11 (R12_11.2)
HV_OFF12: U_HV_Offset_block/U_DAC_Bank_D/U_DAC (IC3_16.4), IJ12 (R12_12.2)
HV_OFF13: U_HV_Offset_block/U_DAC_Bank_D/U_DAC (IC3_14.7), IJ13 (R12_13.2)
HV_OFF14: U_HV_Offset_block/U_DAC_Bank_D/U_DAC (IC3_16.7), IJ14 (R12_14.2)
HV_OFF15: U_HV_Offset_block/U_DAC_Bank_D/U_DAC (IC3_14.9), IJ15 (R12_15.2)
HV_OFF16: U_HV_Offset_block/U_DAC_Bank_D/U_DAC (IC3_16.9), IJ16 (R12_16.2)
HV_OFF17: U_HV_Offset_block/U_DAC_Bank_C/U_DAC (IC3_9.2), IJ17 (R12_17.2)
HV_OFF18: U_HV_Offset_block/U_DAC_Bank_C/U_DAC (IC3_11.2), IJ18 (R12_18.2)
HV_OFF19: U_HV_Offset_block/U_DAC_Bank_C/U_DAC (IC3_9.4), IJ19 (R12_19.2)
HV_OFF20: U_HV_Offset_block/U_DAC_Bank_C/U_DAC (IC3_11.4), IJ20 (R12_20.2)
HV_OFF21: U_HV_Offset_block/U_DAC_Bank_C/U_DAC (IC3_9.7), IJ21 (R12_21.2)
HV_OFF22: U_HV_Offset_block/U_DAC_Bank_C/U_DAC (IC3_11.7), IJ22 (R12_22.2)
HV_OFF23: U_HV_Offset_block/U_DAC_Bank_C/U_DAC (IC3_9.9), IJ23 (R12_23.2)
HV_OFF24: U_HV_Offset_block/U_DAC_Bank_C/U_DAC (IC3_11.9), IJ24 (R12_24.2)
HV_OFF25: U_HV_Offset_block/U_DAC_Bank_C/U_DAC (IC3_10.2), IJ25 (R12_25.2)
HV_OFF26: U_HV_Offset_block/U_DAC_Bank_C/U_DAC (IC3_12.2), IJ26 (R12_26.2)
HV_OFF27: U_HV_Offset_block/U_DAC_Bank_C/U_DAC (IC3_10.4), IJ27 (R12_27.2)
HV_OFF28: U_HV_Offset_block/U_DAC_Bank_C/U_DAC (IC3_12.4), IJ28 (R12_28.2)
HV_OFF29: U_HV_Offset_block/U_DAC_Bank_C/U_DAC (IC3_10.7), IJ29 (R12_29.2)
HV_OFF30: U_HV_Offset_block/U_DAC_Bank_C/U_DAC (IC3_12.7), IJ30 (R12_30.2)
HV_OFF31: U_HV_Offset_block/U_DAC_Bank_C/U_DAC (IC3_10.9), IJ31 (R12_31.2)
HV_OFF32: U_HV_Offset_block/U_DAC_Bank_C/U_DAC (IC3_12.9), IJ32 (R12_32.2)
HV_OFF33: U_HV_Offset_block/U_DAC_Bank_B/U_DAC (IC3_5.2), IJ33 (R12_33.2)
HV_OFF34: U_HV_Offset_block/U_DAC_Bank_B/U_DAC (IC3_7.2), IJ34 (R12_34.2)
HV_OFF35: U_HV_Offset_block/U_DAC_Bank_B/U_DAC (IC3_5.4), IJ35 (R12_35.2)
HV_OFF36: U_HV_Offset_block/U_DAC_Bank_B/U_DAC (IC3_7.4), IJ36 (R12_36.2)
HV_OFF37: U_HV_Offset_block/U_DAC_Bank_B/U_DAC (IC3_5.7), IJ37 (R12_37.2)
HV_OFF38: U_HV_Offset_block/U_DAC_Bank_B/U_DAC (IC3_7.7), IJ38 (R12_38.2)
HV_OFF39: U_HV_Offset_block/U_DAC_Bank_B/U_DAC (IC3_5.9), IJ39 (R12_39.2)
HV_OFF40: U_HV_Offset_block/U_DAC_Bank_B/U_DAC (IC3_7.9), IJ40 (R12_40.2)
HV_OFF41: U_HV_Offset_block/U_DAC_Bank_B/U_DAC (IC3_6.2), IJ41 (R12_41.2)
HV_OFF42: U_HV_Offset_block/U_DAC_Bank_B/U_DAC (IC3_8.2), IJ42 (R12_42.2)
HV_OFF43: U_HV_Offset_block/U_DAC_Bank_B/U_DAC (IC3_6.4), IJ43 (R12_43.2)
HV_OFF44: U_HV_Offset_block/U_DAC_Bank_B/U_DAC (IC3_8.4), IJ44 (R12_44.2)
HV_OFF45: U_HV_Offset_block/U_DAC_Bank_B/U_DAC (IC3_6.7), IJ45 (R12_45.2)
HV_OFF46: U_HV_Offset_block/U_DAC_Bank_B/U_DAC (IC3_8.7), IJ46 (R12_46.2)
HV_OFF47: U_HV_Offset_block/U_DAC_Bank_B/U_DAC (IC3_6.9), IJ47 (R12_47.2)
HV_OFF48: U_HV_Offset_block/U_DAC_Bank_B/U_DAC (IC3_8.9), IJ48 (R12_48.2)
HV_OFF49: U_HV_Offset_block/U_DAC_Bank_A/U_DAC (IC3_1.2), IJ49 (R12_49.2)
HV_OFF50: U_HV_Offset_block/U_DAC_Bank_A/U_DAC (IC3_3.2), IJ50 (R12_50.2)
HV_OFF51: U_HV_Offset_block/U_DAC_Bank_A/U_DAC (IC3_1.4), IJ51 (R12_51.2)
HV_OFF52: U_HV_Offset_block/U_DAC_Bank_A/U_DAC (IC3_3.4), IJ52 (R12_52.2)
HV_OFF53: U_HV_Offset_block/U_DAC_Bank_A/U_DAC (IC3_1.7), IJ53 (R12_53.2)
HV_OFF54: U_HV_Offset_block/U_DAC_Bank_A/U_DAC (IC3_3.7), IJ54 (R12_54.2)
HV_OFF55: U_HV_Offset_block/U_DAC_Bank_A/U_DAC (IC3_1.9), IJ55 (R12_55.2)
HV_OFF56: U_HV_Offset_block/U_DAC_Bank_A/U_DAC (IC3_3.9), IJ56 (R12_56.2)
HV_OFF57: U_HV_Offset_block/U_DAC_Bank_A/U_DAC (IC3_2.2), IJ57 (R12_57.2)
HV_OFF58: U_HV_Offset_block/U_DAC_Bank_A/U_DAC (IC3_4.2), IJ58 (R12_58.2)
HV_OFF59: U_HV_Offset_block/U_DAC_Bank_A/U_DAC (IC3_2.4), IJ59 (R12_59.2)
HV_OFF60: U_HV_Offset_block/U_DAC_Bank_A/U_DAC (IC3_4.4), IJ60 (R12_60.2)
HV_OFF61: U_HV_Offset_block/U_DAC_Bank_A/U_DAC (IC3_2.7), IJ61 (R12_61.2)
HV_OFF62: U_HV_Offset_block/U_DAC_Bank_A/U_DAC (IC3_4.7), IJ62 (R12_62.2)
HV_OFF63: U_HV_Offset_block/U_DAC_Bank_A/U_DAC (IC3_2.9), IJ63 (R12_63.2)
HV_OFF64: U_HV_Offset_block/U_DAC_Bank_A/U_DAC (IC3_4.9), IJ64 (R12_64.2)
NetC12_2: U_HV_Offset_block/U_DAC_Bank_A/U_DAC (R14_1.1), U_HV_Offset_block/U_DAC_Bank_A/U_DAC (R14_2.1), U_HV_Offset_block/U_DAC_Bank_A/U_DAC (R14_3.1), U_HV_Offset_block/U_DAC_Bank_A/U_DAC (R14_4.1), U_HV_Offset_block/U_DAC_Bank_B/U_DAC (R14_5.1), U_HV_Offset_block/U_DAC_Bank_B/U_DAC (R14_6.1), U_HV_Offset_block/U_DAC_Bank_B/U_DAC (R14_7.1), U_HV_Offset_block/U_DAC_Bank_B/U_DAC (R14_8.1), U_HV_Offset_block/U_DAC_Bank_C/U_DAC (R14_9.1), U_HV_Offset_block/U_DAC_Bank_C/U_DAC (R14_10.1), U_HV_Offset_block/U_DAC_Bank_C/U_DAC (R14_11.1), U_HV_Offset_block/U_DAC_Bank_C/U_DAC (R14_12.1), U_HV_Offset_block/U_DAC_Bank_D/U_DAC (R14_13.1), U_HV_Offset_block/U_DAC_Bank_D/U_DAC (R14_14.1), U_HV_Offset_block/U_DAC_Bank_D/U_DAC (R14_15.1), U_HV_Offset_block/U_DAC_Bank_D/U_DAC (R14_16.1), Regulators_block (6 pins)
NetC47_2: Output_block (J3.12), MCU (5 pins)
NetIC4_1_9: U_HV_Offset_block/U_DAC_Bank_A/U_DAC (IC4_1.9), U_HV_Offset_block/U_DAC_Bank_A/U_DAC (IC4_2.9), U_HV_Offset_block/U_DAC_Bank_A/U_DAC (IC4_3.9), U_HV_Offset_block/U_DAC_Bank_A/U_DAC (IC4_4.9), U_HV_Offset_block/U_DAC_Bank_B/U_DAC (IC4_5.9), U_HV_Offset_block/U_DAC_Bank_B/U_DAC (IC4_6.9), U_HV_Offset_block/U_DAC_Bank_B/U_DAC (IC4_7.9), U_HV_Offset_block/U_DAC_Bank_B/U_DAC (IC4_8.9), U_HV_Offset_block/U_DAC_Bank_C/U_DAC (IC4_9.9), U_HV_Offset_block/U_DAC_Bank_C/U_DAC (IC4_10.9), U_HV_Offset_block/U_DAC_Bank_C/U_DAC (IC4_11.9), U_HV_Offset_block/U_DAC_Bank_C/U_DAC (IC4_12.9), U_HV_Offset_block/U_DAC_Bank_D/U_DAC (IC4_13.9), U_HV_Offset_block/U_DAC_Bank_D/U_DAC (IC4_14.9), U_HV_Offset_block/U_DAC_Bank_D/U_DAC (IC4_15.9), U_HV_Offset_block/U_DAC_Bank_D/U_DAC (IC4_16.9), MCU (IC8.38)
NetIC4_1_10: U_HV_Offset_block/U_DAC_Bank_A/U_DAC (IC4_1.10), U_HV_Offset_block/U_DAC_Bank_A/U_DAC (IC4_2.10), U_HV_Offset_block/U_DAC_Bank_A/U_DAC (IC4_3.10), U_HV_Offset_block/U_DAC_Bank_A/U_DAC (IC4_4.10), U_HV_Offset_block/U_DAC_Bank_B/U_DAC (IC4_5.10), U_HV_Offset_block/U_DAC_Bank_B/U_DAC (IC4_6.10), U_HV_Offset_block/U_DAC_Bank_B/U_DAC (IC4_7.10), U_HV_Offset_block/U_DAC_Bank_B/U_DAC (IC4_8.10), U_HV_Offset_block/U_DAC_Bank_C/U_DAC (IC4_9.10), U_HV_Offset_block/U_DAC_Bank_C/U_DAC (IC4_10.10), U_HV_Offset_block/U_DAC_Bank_C/U_DAC (IC4_11.10), U_HV_Offset_block/U_DAC_Bank_C/U_DAC (IC4_12.10), U_HV_Offset_block/U_DAC_Bank_D/U_DAC (IC4_13.10), U_HV_Offset_block/U_DAC_Bank_D/U_DAC (IC4_14.10), U_HV_Offset_block/U_DAC_Bank_D/U_DAC (IC4_15.10), U_HV_Offset_block/U_DAC_Bank_D/U_DAC (IC4_16.10), MCU (IC8.39)
NetIC4_1_11: U_HV_Offset_block/U_DAC_Bank_A/U_DAC (IC4_1.11), U_HV_Offset_block/U_DAC_Bank_A/U_DAC (IC4_2.11), U_HV_Offset_block/U_DAC_Bank_A/U_DAC (IC4_3.11), U_HV_Offset_block/U_DAC_Bank_A/U_DAC (IC4_4.11), U_HV_Offset_block/U_DAC_Bank_B/U_DAC (IC4_5.11), U_HV_Offset_block/U_DAC_Bank_B/U_DAC (IC4_6.11), U_HV_Offset_block/U_DAC_Bank_B/U_DAC (IC4_7.11), U_HV_Offset_block/U_DAC_Bank_B/U_DAC (IC4_8.11), U_HV_Offset_block/U_DAC_Bank_C/U_DAC (IC4_9.11), U_HV_Offset_block/U_DAC_Bank_C/U_DAC (IC4_10.11), U_HV_Offset_block/U_DAC_Bank_C/U_DAC (IC4_11.11), U_HV_Offset_block/U_DAC_Bank_C/U_DAC (IC4_12.11), U_HV_Offset_block/U_DAC_Bank_D/U_DAC (IC4_13.11), U_HV_Offset_block/U_DAC_Bank_D/U_DAC (IC4_14.11), U_HV_Offset_block/U_DAC_Bank_D/U_DAC (IC4_15.11), U_HV_Offset_block/U_DAC_Bank_D/U_DAC (IC4_16.11), MCU (IC8.41)
NetIC9_6: Output_block (J3.25), MCU (IC9.6 R7.1)
NetIC9_7: Output_block (J3.26), MCU (IC9.7 R6.1)
NetL15_2: U_HV_Offset_block/U_DAC_Bank_A/U_DAC (R15_1.1), U_HV_Offset_block/U_DAC_Bank_A/U_DAC (R15_2.1), U_HV_Offset_block/U_DAC_Bank_A/U_DAC (R15_3.1), U_HV_Offset_block/U_DAC_Bank_A/U_DAC (R15_4.1), U_HV_Offset_block/U_DAC_Bank_B/U_DAC (R15_5.1), U_HV_Offset_block/U_DAC_Bank_B/U_DAC (R15_6.1), U_HV_Offset_block/U_DAC_Bank_B/U_DAC (R15_7.1), U_HV_Offset_block/U_DAC_Bank_B/U_DAC (R15_8.1), U_HV_Offset_block/U_DAC_Bank_C/U_DAC (R15_9.1), U_HV_Offset_block/U_DAC_Bank_C/U_DAC (R15_10.1), U_HV_Offset_block/U_DAC_Bank_C/U_DAC (R15_11.1), U_HV_Offset_block/U_DAC_Bank_C/U_DAC (R15_12.1), U_HV_Offset_block/U_DAC_Bank_D/U_DAC (R15_13.1), U_HV_Offset_block/U_DAC_Bank_D/U_DAC (R15_14.1), U_HV_Offset_block/U_DAC_Bank_D/U_DAC (R15_15.1), U_HV_Offset_block/U_DAC_Bank_D/U_DAC (R15_16.1), Regulators_block (L15.2 TP16.1)
O1: CH1 (R2_CH64_1.1), IJ1 (C30_1.2 R13_1.2)
O2: CH2 (R2_CH64_2.1), IJ2 (C30_2.2 R13_2.2)
O3: CH3 (R2_CH64_3.1), IJ3 (C30_3.2 R13_3.2)
O4: CH4 (R2_CH64_4.1), IJ4 (C30_4.2 R13_4.2)
O5: CH5 (R2_CH64_5.1), IJ5 (C30_5.2 R13_5.2)
O6: CH6 (R2_CH64_6.1), IJ6 (C30_6.2 R13_6.2)
O7: CH7 (R2_CH64_7.1), IJ7 (C30_7.2 R13_7.2)
O8: CH8 (R2_CH64_8.1), IJ8 (C30_8.2 R13_8.2)
O9: CH9 (R2_CH64_9.1), IJ9 (C30_9.2 R13_9.2)
O10: CH10 (R2_CH64_10.1), IJ10 (C30_10.2 R13_10.2)
O11: CH11 (R2_CH64_11.1), IJ11 (C30_11.2 R13_11.2)
O12: CH12 (R2_CH64_12.1), IJ12 (C30_12.2 R13_12.2)
O13: CH13 (R2_CH64_13.1), IJ13 (C30_13.2 R13_13.2)
O14: CH14 (R2_CH64_14.1), IJ14 (C30_14.2 R13_14.2)
O15: CH15 (R2_CH64_15.1), IJ15 (C30_15.2 R13_15.2)
O16: CH16 (R2_CH64_16.1), IJ16 (C30_16.2 R13_16.2)
O17: CH17 (R2_CH64_17.1), IJ17 (C30_17.2 R13_17.2)
O18: CH18 (R2_CH64_18.1), IJ18 (C30_18.2 R13_18.2)
O19: CH19 (R2_CH64_19.1), IJ19 (C30_19.2 R13_19.2)
O20: CH20 (R2_CH64_20.1), IJ20 (C30_20.2 R13_20.2)
O21: CH21 (R2_CH64_21.1), IJ21 (C30_21.2 R13_21.2)
O22: CH22 (R2_CH64_22.1), IJ22 (C30_22.2 R13_22.2)
O23: CH23 (R2_CH64_23.1), IJ23 (C30_23.2 R13_23.2)
O24: CH24 (R2_CH64_24.1), IJ24 (C30_24.2 R13_24.2)
O25: CH25 (R2_CH64_25.1), IJ25 (C30_25.2 R13_25.2)
O26: CH26 (R2_CH64_26.1), IJ26 (C30_26.2 R13_26.2)
O27: CH27 (R2_CH64_27.1), IJ27 (C30_27.2 R13_27.2)
O28: CH28 (R2_CH64_28.1), IJ28 (C30_28.2 R13_28.2)
O29: CH29 (R2_CH64_29.1), IJ29 (C30_29.2 R13_29.2)
O30: CH30 (R2_CH64_30.1), IJ30 (C30_30.2 R13_30.2)
O31: CH31 (R2_CH64_31.1), IJ31 (C30_31.2 R13_31.2)
O32: CH32 (R2_CH64_32.1), IJ32 (C30_32.2 R13_32.2)
O33: CH33 (R2_CH64_33.1), IJ33 (C30_33.2 R13_33.2)
O34: CH34 (R2_CH64_34.1), IJ34 (C30_34.2 R13_34.2)
O35: CH35 (R2_CH64_35.1), IJ35 (C30_35.2 R13_35.2)
O36: CH36 (R2_CH64_36.1), IJ36 (C30_36.2 R13_36.2)
O37: CH37 (R2_CH64_37.1), IJ37 (C30_37.2 R13_37.2)
O38: CH38 (R2_CH64_38.1), IJ38 (C30_38.2 R13_38.2)
O39: CH39 (R2_CH64_39.1), IJ39 (C30_39.2 R13_39.2)
O40: CH40 (R2_CH64_40.1), IJ40 (C30_40.2 R13_40.2)
O41: CH41 (R2_CH64_41.1), IJ41 (C30_41.2 R13_41.2)
O42: CH42 (R2_CH64_42.1), IJ42 (C30_42.2 R13_42.2)
O43: CH43 (R2_CH64_43.1), IJ43 (C30_43.2 R13_43.2)
O44: CH44 (R2_CH64_44.1), IJ44 (C30_44.2 R13_44.2)
O45: CH45 (R2_CH64_45.1), IJ45 (C30_45.2 R13_45.2)
O46: CH46 (R2_CH64_46.1), IJ46 (C30_46.2 R13_46.2)
O47: CH47 (R2_CH64_47.1), IJ47 (C30_47.2 R13_47.2)
O48: CH48 (R2_CH64_48.1), IJ48 (C30_48.2 R13_48.2)
O49: CH49 (R2_CH64_49.1), IJ49 (C30_49.2 R13_49.2)
O50: CH50 (R2_CH64_50.1), IJ50 (C30_50.2 R13_50.2)
O51: CH51 (R2_CH64_51.1), IJ51 (C30_51.2 R13_51.2)
O52: CH52 (R2_CH64_52.1), IJ52 (C30_52.2 R13_52.2)
O53: CH53 (R2_CH64_53.1), IJ53 (C30_53.2 R13_53.2)
O54: CH54 (R2_CH64_54.1), IJ54 (C30_54.2 R13_54.2)
O55: CH55 (R2_CH64_55.1), IJ55 (C30_55.2 R13_55.2)
O56: CH56 (R2_CH64_56.1), IJ56 (C30_56.2 R13_56.2)
O57: CH57 (R2_CH64_57.1), IJ57 (C30_57.2 R13_57.2)
O58: CH58 (R2_CH64_58.1), IJ58 (C30_58.2 R13_58.2)
O59: CH59 (R2_CH64_59.1), IJ59 (C30_59.2 R13_59.2)
O60: CH60 (R2_CH64_60.1), IJ60 (C30_60.2 R13_60.2)
O61: CH61 (R2_CH64_61.1), IJ61 (C30_61.2 R13_61.2)
O62: CH62 (R2_CH64_62.1), IJ62 (C30_62.2 R13_62.2)
O63: CH63 (R2_CH64_63.1), IJ63 (C30_63.2 R13_63.2)
O64: CH64 (R2_CH64_64.1), IJ64 (C30_64.2 R13_64.2)
VS: Bank (J1.1), Regulators_block (11 pins)